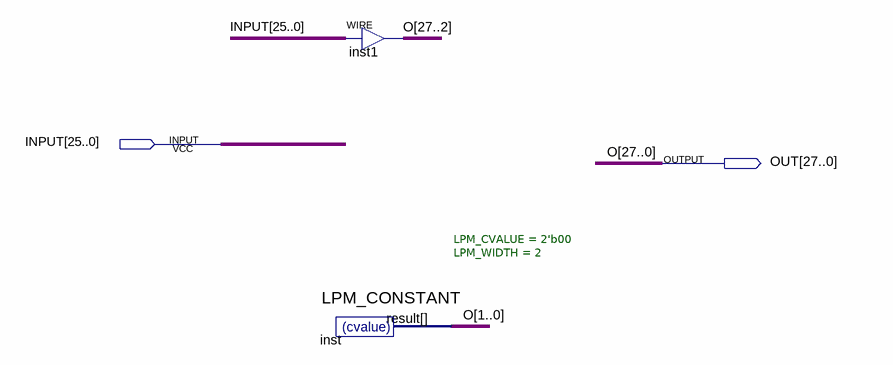
[diagram p0: schematic sheet]
// Quartus schematic leftshift25.bdf as structural Verilog: 2 symbols, 2 pins
module leftshift25 (
  input  [25:0] INPUT,
  output [27:0] OUT
);

  assign OUT[27:2] = INPUT;  // WIRE inst1
  LPM_CONSTANT #(.LPM_CVALUE(2'b00), .LPM_WIDTH(2)) inst (.result(OUT[1:0]));

  // Other names for the same wires on the sheet: O[27:0] = OUT
endmodule
